# Altium schematic sheet Digital_Outputs.SchDoc
size A4
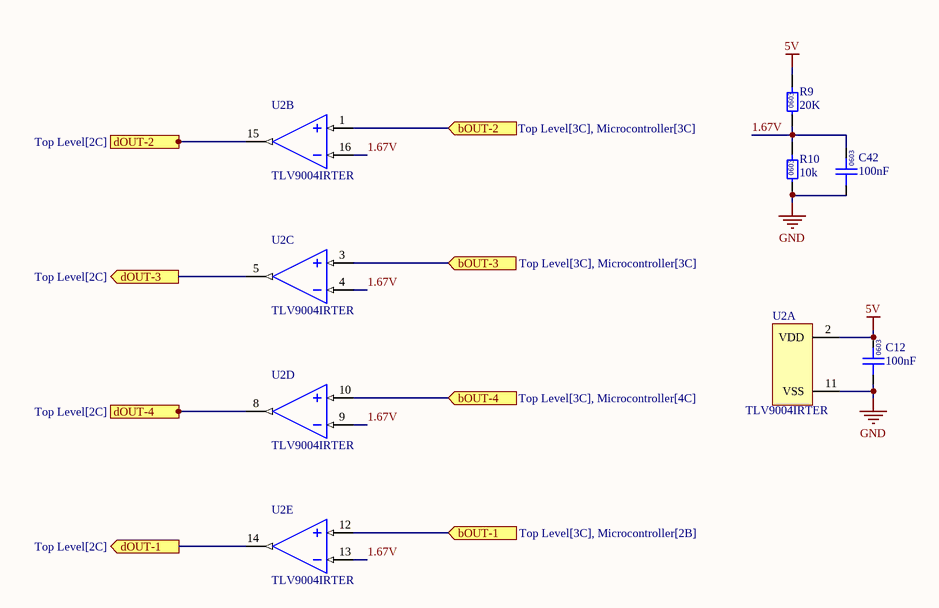
[diagram p0: Digital_Outputs.SchDoc]

## Parts
C12  100nF  [0603]
C42  100nF  [0603]
R9  20K  [0603]
R10  10k  [0603]
U2  TLV9004IRTER  [TI 16-WQFN (3x3, 1.68mm)]  (parts A,B,C,D,E of 5)

## Ports
bOUT-1 (in, see Top Level[3C], Microcontroller[2B]), bOUT-2 (in, see Top Level[3C], Microcontroller[3C]), bOUT-3 (in, see Top Level[3C], Microcontroller[3C]), bOUT-4 (in, see Top Level[3C], Microcontroller[4C]), dOUT-1 (out, see Top Level[2C]), dOUT-2 (out, see Top Level[2C]), dOUT-3 (out, see Top Level[2C]), dOUT-4 (out, see Top Level[2C])

## Nets
5V: C12.2 R9.2 U2.2(VDD)
GND: C12.1 C42.1 R10.1 U2.11(VSS)
1.67V: C42.2 R9.1 R10.2 U2.4(2IN-) U2.9(3IN-) U2.13(4IN-) U2.16(1IN+)
bOUT-1: U2.12(4IN+) ; port bOUT-1
bOUT-2: U2.1(1IN+) ; port bOUT-2
bOUT-3: U2.3(2IN+) ; port bOUT-3
bOUT-4: U2.10(3IN+) ; port bOUT-4
dOUT-1: U2.14(4OUT) ; port dOUT-1
dOUT-2: U2.15(1OUT) ; port dOUT-2
dOUT-3: U2.5(2OUT) ; port dOUT-3
dOUT-4: U2.8(3OUT) ; port dOUT-4

## Notes on the sheet
- (in symbol GCM188L81H104KA57D) 0603
- (in symbol RC0603FR-0710KL) 0603
- (in symbol RC0603FR-0720KL) 0603

## Library data of the parts
C12 C42 = GCM188L81H104KA57D: Manufacturer: muRata; Rated Voltage: 50V; Tolerance: ±10%; Material: MLCC; Temperature Rating: X8L; Part Number: GCM188L81H104KA57D; Value: 100nF; Digikey Part Number: 490-6049-1-ND
R9 = RC0603FR-0720KL: Manufacturer: YAGEO; Tolerance: 0.01; Rated Power: 0.1W; Part Number: RC0603FR-0720KL; Value: 20K; Material: FR-07; Digikey Part Number: 311-20.0KHRCT-ND
R10 = RC0603FR-0710KL: Manufacturer: YAGEO; Tolerance: 0.01; Rated Power: 0.1W; Part Number: RC0603FR-0710KL; Value: 10k; Material: FR-07; Digikey Part Number: 311-10.0KHRCT-ND
U2 = TLV9004IRTER: IC OPAMP GP 4 CIRCUIT 16WQFN; Manufacturer: Texas Instruments; Complex IC: 0; Part Number: TLV9004IRTER; Digikey Part Number: 296-51828-1-ND; Digikey Link: https://www.digikey.com.au/en/products/detail/texas-instruments/TLV9004IRTER/9674913